# Altium project PROC154E3_SCH.PrjPcb (part 56 of 60)

## Sheet 60. SVS MONITOR.SchDoc: PMIC SUPPORT CIRCUIT
size 513 x 386 mm; Project: PROC154E2(001)_SK_AM69; Issue: 1.0; RevCode: E3; Page Create Date: March  8, 1995; Variant Name: Core Design; Schematic Page Number: 60; Page Number: 60; Page Size: C; Comment: MISTRAL_TITLEBLK_CSIZE_1; Page Count: 62; Schematic Page Count: 62; Name: PROC154E2 001 SK AM69; DsnPath: C:\Users\danie\Downloads\sprr466c\PROC154E3_RP\PROC154E3_SCH.DSN; SchematicName: SCHEMATIC1; PageName: 60. SVS MONITOR; PageSize: C; TopSchematic: True
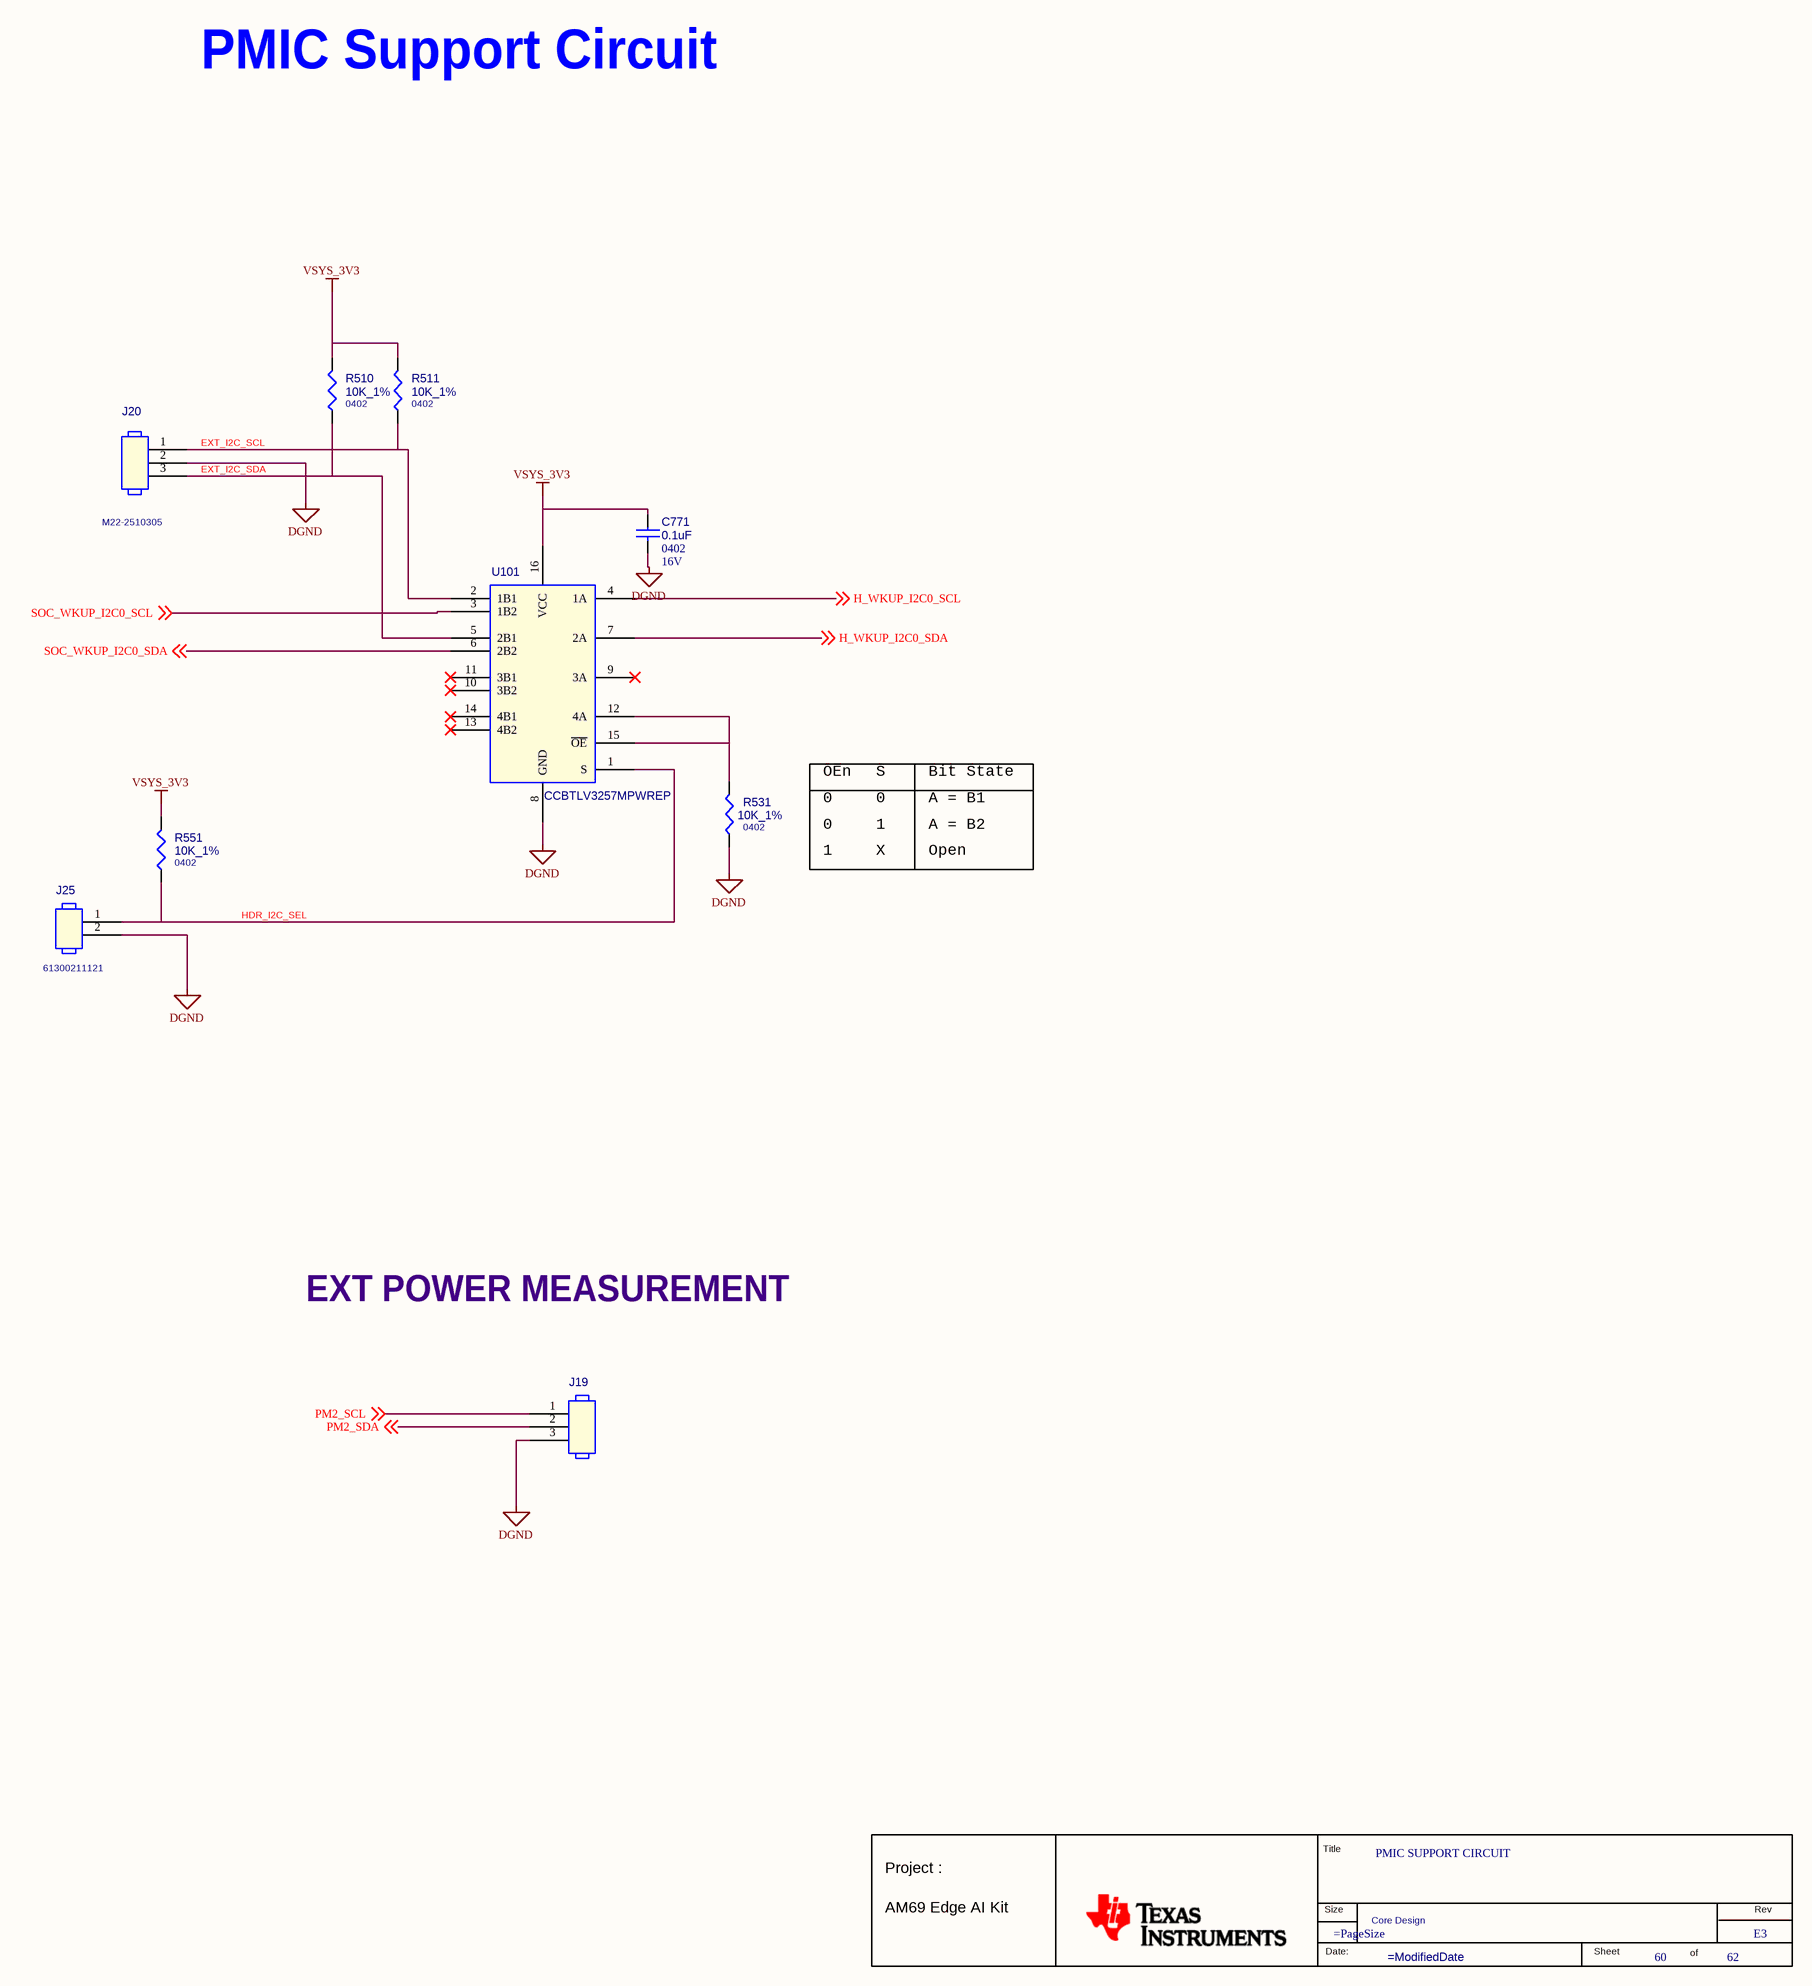
[diagram p101: 60. SVS MONITOR.SchDoc]

### Parts
(Parts that share a designator on the sheet are numbered #1, #2 ... from top to bottom, then left to right.)
*#60  RevCode: E3  Title: PMIC SUPPORT CIRCUIT  Page Number: 60  Page Count: 62  Variant Name: Core Design  (hidden comment: MISTRAL_TITLEBLK_CSIZE_1)  (graphical)
C771  0.1uF  Voltage: 16V  Package: 0402  [CAP0402_0-75]
J19  HDR_1X3  [HDR_1X3_100_S_T]  (value not drawn)
J20  Mfr_part_number: M22-2510305  [HDR_1X3_78-74_S_T]  (hidden comment: HDR_1X3)
J25  Mfr_part_number: 61300211121  [HDR_1X2_61300211121_S_T_8-6]  (hidden comment: HDR_1X2)
R510  10K_1%  Package: 0402  [RES0402_0-5]
R511  10K_1%  Package: 0402  [RES0402_0-5]
R531  10K_1%  Package: 0402  [RES0402_0-5]
R551  10K_1%  Package: 0402  [RES0402_0-5]
U101  CCBTLV3257MPWREP  [TSSOP16_25-59_205X180_1-2]

### Nets
DGND: C771.2 J19.3 J20.2 J25.2 R531.2 U101.8(GND)  [project net VDD_CPU_HCPS_GOSNS]
VSYS_3V3: C771.1 R510.2 R511.2 R551.2 U101.16(VCC)  [project net V_3V3]
EXT_I2C_SCL: J20.1 R511.1 U101.2(1B1)
EXT_I2C_SDA: J20.3 R510.1 U101.5(2B1)
H_WKUP_I2C0_SCL: U101.4(1A) ; off-sheet H_WKUP_I2C0_SCL
H_WKUP_I2C0_SDA: U101.7(2A) ; off-sheet H_WKUP_I2C0_SDA
HDR_I2C_SEL: J25.1 R551.1 U101.1(S)
PM2_SCL: J19.1 ; off-sheet PM2_SCL
PM2_SDA: J19.2 ; off-sheet PM2_SDA
SOC_WKUP_I2C0_SCL: U101.3(1B2) ; off-sheet SOC_WKUP_I2C0_SCL
SOC_WKUP_I2C0_SDA: U101.6(2B2) ; off-sheet SOC_WKUP_I2C0_SDA
NetR531_1: R531.1 U101.12(4A) U101.15(~{OE})

Not connected (* = marked no-connect by the designer): U101 9(3A)* 10(3B2)* 11(3B1)* 13(4B2)* 14(4B1)*

### Notes on the sheet
- PMIC Support Circuit
- OEn
- 0
- S
- Bit State
- A = B1
- 1
- X
- A = B2
- Open
- EXT POWER MEASUREMENT
- (in symbol MISTRAL_TITLEBLK_CSIZE_1) Title; Project :; Size; Rev; AM69 Edge AI Kit; Date:; Sheet; of

### Library data of the parts
*#60 = MISTRAL_TITLEBLK_CSIZE_1: as *#56 on sheet 56. SOC LDOs & LD SWITCHES; Page Create Date: March  8, 1995; Page Size: =PageSize; Page Modify Date: =ModifiedDate; Schematic Page Count: 62; Schematic Page Number: 60
C771 = CAP_Dup1: CAP CERAMIC 0.1uF 16V 10% X7R AUTO 0402; Part Reference: C771; Manufacturer: MURATA; Automotive Alternate_mfr_part_number: CGA2B1X7R1C104K050BC; Automotive Alternate_mfr_name: TDK; Direct Alternate_mfr_part_number: GCM155R71C104JA55D; Mistral Part No: 120016070006-R; Mfr_part_number: GCM155R71C104KA55D; Part_type: CAPACITORS\CERAMIC; Project: DCMIST_FPGA_CARD; Wattage: NA; Customs_HS_Code: 85322990; Custom_Duty: 15%; Value: 0.1uF; PCB Footprint: CAP0402_0-75; Direct Alternate_mfr_name: MURATA; Footprint Ref: CAP0402_0-75; Mfr_name: MURATA; Tolerance: 10%; Distributor_name: DIGIKEY; Distributor_part_number: 490-4759-1-ND; Library Ref: CAP; Height: 0.55MM; Weight: 6mg; Temperature: -55°C+125°C; Datasheet: Y:\MIS_DATABASE\DATASHEETS\CAPACITORS\MURATA-GCM-SER.PDF; Crtd /date: VASANTHA/300514; Chkd/date: NAVEED/021014; MECHANICAL 3D STEP FILE: CAP0402_0-75; Library Path: Y:\MIS_DATABASE\Library\ALTIUM_TOOL\SCHEMATICS_PARTS\MS_DISCRETE_Library.schlib; Footprint Path: Y:\MIS_DATABASE\Library\ALTIUM_TOOL\PCB_FOOTPRINTS\Altium_Footprint_Lib.PcbLib
J19 = HEADER_3X1: CON HDR 1X3 2.54MM PITCH ST TH; Part Reference: J19; Mistral Part No: 150015100037-R; Mfr_name: WURTH ELECTRONICS INC; Mfr_part_number: 61300311121; Part_type: CONNECTOR\HEADERS; Project: CYPHY_ROADKILL; Tolerance: NA; Customs_HS_Code: 85369090; Custom_Duty: 24%; Value: HDR_1X3; PCB Footprint: HDR_1X3_100_S_T; Voltage: NA; Wattage: NA; Package: THRU-HOLE; Distributor_name: DIGIKEY; Distributor_part_number: 732-5316-ND; Library Ref: HEADER_3X1; Height: 8.54MM; Weight: NA; Temperature: NA; Datasheet: Y:\MIS_DATABASE\DATASHEETS\CONNECTORS\6130XXX.PDF; Crtd /date: VASANTHA/211015; Chkd/date: VASANTHA/211015
J20 = HEADER_3X1: CON HDR 1X3 2.00MM PITCH ST TH; Part Reference: J20; Manufacturer: HARWIN INC; Part_type: CONNECTOR\HEADERS; Mistral Part No: 150015110010-R; Custom_Duty: 24%; Customs_HS_Code: 85369090; Wattage: NA; Project: ZK_BIOMETRIC; Value: HDR_1X3; PCB Footprint: HDR_1X3_78-74_S_T; Chkd/date: VASANTHA/04115; Crtd /date: VASANTHA/04115; Datasheet: Y:\MIS_DATABASE\DATASHEETS\CONNECTORS\M22-251.PDF; Temperature: -40°C+105°C; Weight: NA; Height: 5.25MM; Library Ref: HEADER_3X1; Distributor_part_number: 952-1312-ND; Distributor_name: DIGIKEY; Package: THRU-HOLE; Voltage: NA; Tolerance: NA; Mfr_name: HARWIN INC
J25 = HEADER_2X1: CON HDR 1X2 2.54MM PITCH ST TH; Part Reference: J25; Part_type: CONNECTOR\HEADERS; Mfr_name: WURTH ELECTRONICS; Mistral Part No: 150018100003-R; Custom_Duty: 24%; Customs_HS_Code: 85369090; Wattage: NA; Project: ALPINE_EVM; Value: HDR_1X2; PCB Footprint: HDR_1X2_61300211121_S_T_8-6; Footprint Path: Y:\MIS_DATABASE\Library\ALTIUM_TOOL\PCB_FOOTPRINTS\Altium_Footprint_Lib.PcbLib; Library Path: Y:\MIS_DATABASE\Library\ALTIUM_TOOL\SCHEMATICS_PARTS\MS_CONNECTOR_Library.schlib; MECHANICAL 3D STEP FILE: HDR_1X2_61300211121_S_T_8-6; Chkd/date: MANIRAJA/031018; Crtd /date: ALVY/031018; Datasheet: Y:\MIS_DATABASE\DATASHEETS\CONNECTORS\6130XXX.PDF; Temperature: -40°C+105°C; Weight: 120mg; Height: 8.54MM; Library Ref: HEADER_2X1; Distributor_part_number: 732-5315-ND; Distributor_name: DIGIKEY; Package: THRU-HOLE; Voltage: NA; Tolerance: NA; Footprint Ref: HDR_1X2_61300211121_S_T_8-6
R510 = RESISTOR_Dup2: RES 10K 1/16W 1% 0402; Part Reference: R510; Manufacturer: YAGEO AMERICA; Part_type: RESISTORS\FIXED; Mfr_part_number: RC0402FR-0710KL; Mistral Part No: 110015090015-R; Custom_Duty: 15%; Customs_HS_Code: 85332119; Voltage: NA; Project: VOCERA; Value: 10K_1%; PCB Footprint: RES0402_0-5; Footprint Path: Y:\MIS_DATABASE\Library\ALTIUM_TOOL\PCB_FOOTPRINTS\Altium_Footprint_Lib.PcbLib; Library Path: Y:\MIS_DATABASE\Library\ALTIUM_TOOL\SCHEMATICS_PARTS\MS_DISCRETE_Library.schlib; MECHANICAL 3D STEP FILE: RES0402_0-5; Chkd/date: VASANTHA/201216; Crtd /date: GEETHA/290506; Datasheet: Y:\MIS_DATABASE\DATASHEETS\RESISTORS\RCXXXXL-SER_MAR18.PDF; Temperature: -55°C+155°C; Weight: 0.65mg; Height: 0.40MM; Library Ref: RESISTOR; Distributor_part_number: 311-10.0KLRTR-ND; Distributor_name: DIGIKEY; Wattage: 1/16W; Tolerance: 1%; Mfr_name: YAGEO AMERICA; Footprint Ref: RES0402_0-5
R511 = RESISTOR_Dup2: RES 10K 1/16W 1% 0402; Part Reference: R511; Mistral Part No: 110015090015-R; Mfr_name: YAGEO AMERICA; Mfr_part_number: RC0402FR-0710KL; Part_type: RESISTORS\FIXED; Project: VOCERA; Voltage: NA; Customs_HS_Code: 85332119; Custom_Duty: 15%; Value: 10K_1%; PCB Footprint: RES0402_0-5; Footprint Ref: RES0402_0-5; Tolerance: 1%; Wattage: 1/16W; Distributor_name: DIGIKEY; Distributor_part_number: 311-10.0KLRTR-ND; Library Ref: RESISTOR; Height: 0.40MM; Weight: 0.65mg; Temperature: -55°C+155°C; Datasheet: Y:\MIS_DATABASE\DATASHEETS\RESISTORS\RCXXXXL-SER_MAR18.PDF; Crtd /date: GEETHA/290506; Chkd/date: VASANTHA/201216; MECHANICAL 3D STEP FILE: RES0402_0-5; Library Path: Y:\MIS_DATABASE\Library\ALTIUM_TOOL\SCHEMATICS_PARTS\MS_DISCRETE_Library.schlib; Footprint Path: Y:\MIS_DATABASE\Library\ALTIUM_TOOL\PCB_FOOTPRINTS\Altium_Footprint_Lib.PcbLib; Manufacturer: YAGEO AMERICA
R531 = RESISTOR_Dup2: RES 10K 1/16W 1% 0402; Part Reference: R531; Manufacturer: YAGEO AMERICA; Part_type: RESISTORS\FIXED; Mfr_part_number: RC0402FR-0710KL; Mistral Part No: 110015090015-R; Custom_Duty: 15%; Customs_HS_Code: 85332119; Voltage: NA; Project: VOCERA; Value: 10K_1%; PCB Footprint: RES0402_0-5; Footprint Path: Y:\MIS_DATABASE\Library\ALTIUM_TOOL\PCB_FOOTPRINTS\Altium_Footprint_Lib.PcbLib; Library Path: Y:\MIS_DATABASE\Library\ALTIUM_TOOL\SCHEMATICS_PARTS\MS_DISCRETE_Library.schlib; MECHANICAL 3D STEP FILE: RES0402_0-5; Chkd/date: VASANTHA/201216; Crtd /date: GEETHA/290506; Datasheet: Y:\MIS_DATABASE\DATASHEETS\RESISTORS\RCXXXXL-SER_MAR18.PDF; Temperature: -55°C+155°C; Weight: 0.65mg; Height: 0.40MM; Library Ref: RESISTOR; Distributor_part_number: 311-10.0KLRTR-ND; Distributor_name: DIGIKEY; Wattage: 1/16W; Tolerance: 1%; Mfr_name: YAGEO AMERICA; Footprint Ref: RES0402_0-5
R551 = RESISTOR_Dup2: RES 10K 1/16W 1% 0402; Part Reference: R551; Mistral Part No: 110015090015-R; Mfr_name: YAGEO AMERICA; Mfr_part_number: RC0402FR-0710KL; Part_type: RESISTORS\FIXED; Project: VOCERA; Voltage: NA; Customs_HS_Code: 85332119; Custom_Duty: 15%; Value: 10K_1%; PCB Footprint: RES0402_0-5; Footprint Ref: RES0402_0-5; Tolerance: 1%; Wattage: 1/16W; Distributor_name: DIGIKEY; Distributor_part_number: 311-10.0KLRTR-ND; Library Ref: RESISTOR; Height: 0.40MM; Weight: 0.65mg; Temperature: -55°C+155°C; Datasheet: Y:\MIS_DATABASE\DATASHEETS\RESISTORS\RCXXXXL-SER_MAR18.PDF; Crtd /date: GEETHA/290506; Chkd/date: VASANTHA/201216; MECHANICAL 3D STEP FILE: RES0402_0-5; Library Path: Y:\MIS_DATABASE\Library\ALTIUM_TOOL\SCHEMATICS_PARTS\MS_DISCRETE_Library.schlib; Footprint Path: Y:\MIS_DATABASE\Library\ALTIUM_TOOL\PCB_FOOTPRINTS\Altium_Footprint_Lib.PcbLib; Manufacturer: YAGEO AMERICA
U101 = SN74CBTLV3257D_SOIC16: IC 4BIT 1-OF-2 FET MULTIPLEXER/DEMULTIPLEXER TSSOP16; Part Reference: U101; Mistral Part No: 141019040004-R; Mfr_name: TEXAS INSTRUMENTS; Part_type: ICS\DIGITAL\COMBINATIONAL; Project: J7ES_SOM_DUAL-LEO_PMIC; Tolerance: NA; Customs_HS_Code: 85423100; Custom_Duty: 15%; Value: CCBTLV3257MPWREP; PCB Footprint: TSSOP16_25-59_205X180_1-2; Footprint Ref: TSSOP16_25-59_205X180_1-2; Mfr_part_number: CCBTLV3257MPWREP; Voltage: NA; Wattage: NA; Package: TSSOP16; Distributor_name: DIGIKEY; Distributor_part_number: 296-23728-1-ND; Library Ref: SN74CBTLV3257D_SOIC16; Height: 1.20MM; Weight: 62mg; Temperature: -55°C+125°C; Datasheet: Y:\MIS_DATABASE\DATASHEETS\ICS\DIGITAL\COMBINATIONAL\SN74CBTLV3257-EP.PDF; Crtd /date: ALVY/290419; Chkd/date: MANIRAJA/290419; MECHANICAL 3D STEP FILE: TSSOP16_25-59_205X180_1-2; Library Path: Y:\MIS_DATABASE\Library\ALTIUM_TOOL\SCHEMATICS_PARTS\MS_COMBINATIONAL_Library.schlib; Footprint Path: Y:\MIS_DATABASE\Library\ALTIUM_TOOL\PCB_FOOTPRINTS\Altium_Footprint_Lib.PcbLib; Manufacturer: TEXAS INSTRUMENTS